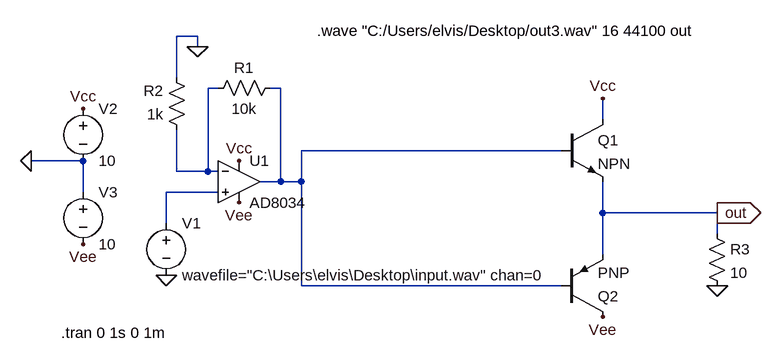
[diagram p0: schematic music_amp.asc]
music_amp.asc, the LTspice schematic file:
Version 4
SHEET 1 1252 680
WIRE 64 -160 32 -160
WIRE 64 -144 64 -160
WIRE 32 -96 32 -160
WIRE 96 -80 80 -80
WIRE 192 -80 176 -80
WIRE 688 -32 688 -64
WIRE 624 16 224 16
WIRE -112 32 -192 32
WIRE 32 48 32 -16
WIRE 80 48 80 -80
WIRE 80 48 32 48
WIRE 96 48 80 48
WIRE 192 64 192 -80
WIRE 192 64 160 64
WIRE 224 64 224 16
WIRE 224 64 192 64
WIRE -112 80 -112 32
WIRE 96 80 16 80
WIRE 688 112 688 64
WIRE 864 112 688 112
WIRE 16 128 16 80
WIRE 864 144 864 112
WIRE 688 176 688 112
WIRE 224 224 224 64
WIRE 624 224 224 224
FLAG 16 208 0
FLAG -192 32 0
FLAG 688 -64 Vcc
FLAG -112 -48 Vcc
FLAG 864 224 0
FLAG -112 160 Vee
FLAG 688 272 Vee
FLAG 864 112 out
IOPIN 864 112 Out
FLAG 128 32 Vcc
FLAG 128 96 Vee
FLAG 64 -144 0
SYMBOL voltage 16 112 R0
WINDOW 123 0 0 Left 2
WINDOW 39 0 0 Left 2
SYMATTR InstName V1
SYMATTR Value wavefile="C:\Users\elvis\Desktop\input.wav" chan=0
SYMBOL npn 624 -32 R0
SYMATTR InstName Q1
SYMBOL pnp 624 272 M180
SYMATTR InstName Q2
SYMBOL voltage -112 -64 R0
WINDOW 123 0 0 Left 2
WINDOW 39 0 0 Left 2
SYMATTR InstName V2
SYMATTR Value 10
SYMBOL res 848 128 R0
SYMATTR InstName R3
SYMATTR Value 10
SYMBOL voltage -112 64 R0
WINDOW 123 0 0 Left 2
WINDOW 39 0 0 Left 2
SYMATTR InstName V3
SYMATTR Value 10
SYMBOL Opamps\\AD8034 128 0 R0
SYMATTR InstName U1
SYMBOL res 192 -96 R90
WINDOW 0 0 56 VBottom 2
WINDOW 3 32 56 VTop 2
SYMATTR InstName R1
SYMATTR Value 10k
SYMBOL res 48 0 R180
WINDOW 0 36 76 Left 2
WINDOW 3 36 40 Left 2
SYMATTR InstName R2
SYMATTR Value 1k
TEXT -146 296 Left 2 !.tran 0 1s 0 1m
TEXT 248 -168 Left 2 !.wave "C:/Users/elvis/Desktop/out3.wav" 16 44100 out

The netlist it stands for:
* music_amp.asc
V1 N003 0 wavefile="C:\Users\elvis\Desktop\input.wav" chan=0
Q1 Vcc N002 out 0 NPN
Q2 Vee N002 out 0 PNP
V2 Vcc 0 10
R3 out 0 10
V3 0 Vee 10
XU1 N003 N001 Vcc Vee N002 AD8034  ; pins In+ In- V+ V- OUT
R1 N002 N001 10k
R2 N001 0 1k
.model NPN NPN
.model PNP PNP
.lib standard.bjt
.tran 0 1s 0 1m
.wave "C:/Users/elvis/Desktop/out3.wav" 16 44100 out
.backanno
.end